# Altium schematic sheet Sheet3.SchDoc
size A
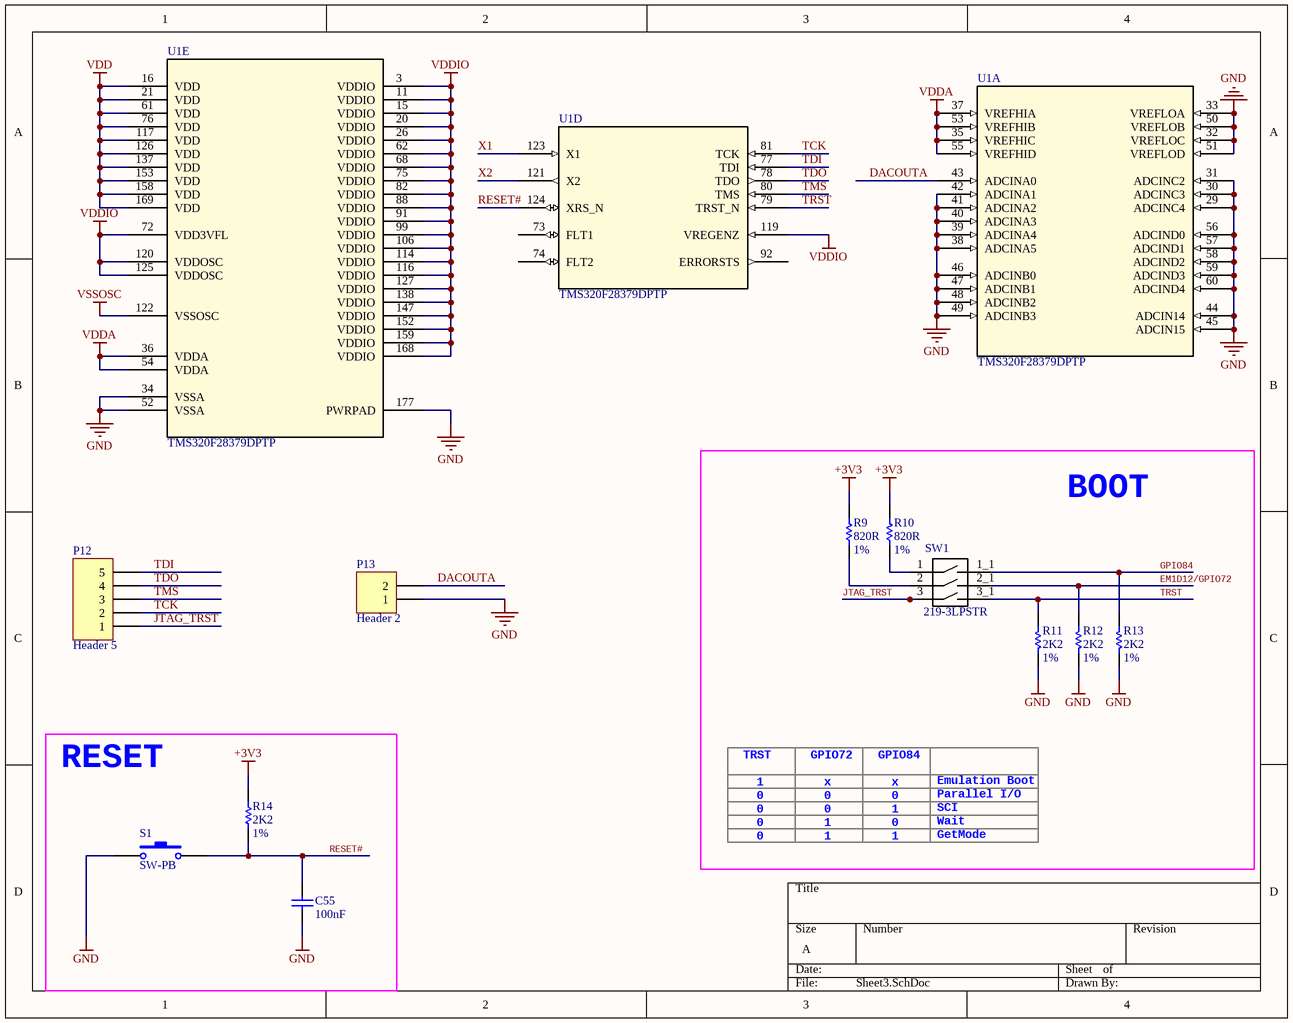
[diagram p0: Sheet3.SchDoc]

## Parts
C55  100nF  [C0805]
P12  Header 5  [HDR1X5]
P13  Header 2  [HDR1X2]
R9  Rating: 1%  [6-0805_L]  (hidden comment: 820R)
R10  Rating: 1%  [6-0805_L]  (hidden comment: 820R)
R11  Rating: 1%  [6-0805_L]  (hidden comment: 2K2)
R12  Rating: 1%  [6-0805_L]  (hidden comment: 2K2)
R13  Rating: 1%  [6-0805_L]  (hidden comment: 2K2)
R14  Rating: 1%  [6-0805_L]  (hidden comment: 2K2)
S1  SW-PB  [SW PB]
SW1  219-3LPSTR  [3Switch*SW_219-3LPSTR3W219-3LPSTR(Primary)]
U1  TMS320F28379DPTP  [PTP0176F_L]  (parts A,D,E of 5)

## Blocks framed on the sheet
BOOT: R9-R13 SW1
RESET: C55 R14 S1

## Nets
+3V3: R9.2 R10.2 R14.2
GND: C55.2 P13.1 R11.1 R12.1 R13.1 S1.1 U1.29(ADCINC4) U1.30(ADCINC3) U1.31(ADCINC2) U1.32(VREFLOC) U1.33(VREFLOA) U1.34(VSSA) U1.38(ADCINA5) U1.39(ADCINA4) U1.40(ADCINA3) U1.41(ADCINA2) U1.42(ADCINA1) U1.44(ADCIN14) U1.45(ADCIN15) U1.46(ADCINB0) U1.47(ADCINB1) U1.48(ADCINB2) U1.49(ADCINB3) U1.50(VREFLOB) U1.51(VREFLOD) U1.52(VSSA) U1.56(ADCIND0) U1.57(ADCIND1) U1.58(ADCIND2) U1.59(ADCIND3) U1.60(ADCIND4) U1.177(PWRPAD)
VDD: U1.16(VDD) U1.21(VDD) U1.61(VDD) U1.76(VDD) U1.117(VDD) U1.126(VDD) U1.137(VDD) U1.153(VDD) U1.158(VDD) U1.169(VDD)
VDDA: U1.35(VREFHIC) U1.36(VDDA) U1.37(VREFHIA) U1.53(VREFHIB) U1.54(VDDA) U1.55(VREFHID)
VDDIO: U1.3(VDDIO) U1.11(VDDIO) U1.15(VDDIO) U1.20(VDDIO) U1.26(VDDIO) U1.62(VDDIO) U1.68(VDDIO) U1.72(VDD3VFL) U1.75(VDDIO) U1.82(VDDIO) U1.88(VDDIO) U1.91(VDDIO) U1.99(VDDIO) U1.106(VDDIO) U1.114(VDDIO) U1.116(VDDIO) U1.119(VREGENZ) U1.120(VDDOSC) U1.125(VDDOSC) U1.127(VDDIO) U1.138(VDDIO) U1.147(VDDIO) U1.152(VDDIO) U1.159(VDDIO) U1.168(VDDIO)
VSSOSC: U1.122(VSSOSC)
DACOUTA: P13.2 U1.43(ADCINA0)
EM1D12/GPIO72: R12.2 SW1.2_1
GPIO84: R13.2 SW1.1_1
JTAG_TRST: P12.1 SW1.3
RESET#: C55.1 R14.1 S1.2 U1.124(XRS_N)
TCK: P12.2 U1.81(TCK)
TDI: P12.5 U1.77(TDI)
TDO: P12.4 U1.78(TDO)
TMS: P12.3 U1.80(TMS)
TRST: R11.2 SW1.3_1 U1.79(TRST_N)
X1: U1.123(X1)
X2: U1.121(X2)
NetR9_1: R9.1 SW1.2
NetR10_1: R10.1 SW1.1

Not connected (* = marked no-connect by the designer): U1 73(FLT1) 74(FLT2) 92(ERRORSTS)

## Notes on the sheet
- TRST
- GPIO72
- GPIO84
- 1
- 0
- x
- Emulation Boot
- Parallel I/O
- SCI
- Wait
- GetMode

## Library data of the parts
C55 = 1004001100187: CAP,100NF(0.1uf),+/-10%,X5R,10V,SMD0402; Manufacturer: MURATA; Manufacturer Part Number: GRM155R61A104KA01D; Rating: 10%; Embest PN: 1004001100187; Value: 100nF; Part Type: Ceramic Capacitor
P12 = Header 5: Header, 5-Pin; LatestRevisionDate: 17-Jul-2002; LatestRevisionNote: Re-released for DXP Platform.; Publisher: Altium Limited
P13 = Header 2: Header, 2-Pin; LatestRevisionDate: 17-Jul-2002; LatestRevisionNote: Re-released for DXP Platform.; Publisher: Altium Limited
R9 R10 = 1003001100482: RES,820R,+/-1%,1/16W,SMD0402; Manufacturer: YAGEO; Manufacturer Part Number: RC0402FR-07820RL; Embest PN: 1003001100482; Value: 820R; Part Type: Thick film Resistor
R11-R14 = 1003001100045: RES,2K2,+/-1%,1/16W,SMD0402; Manufacturer: YAGEO; Manufacturer Part Number: RC0402FR-072K2L; Embest PN: 1003001100045; Value: 2K2; Part Type: Thick film Resistor
S1 = SW-PB: DIGIKEY SW400-ND; Published: 24-Mar-1999; LatestRevisionDate: 17-Jul-2002; LatestRevisionNote: Re-released for DXP Platform.; Publisher: Altium Limited
SW1 = 219-3LPSTR: Dip Switch SPST 3 Position Surface Mount Slide _Standard_ Actuator 100mA 20VDC; MF: CTS Electrocomponents; SnapEDA_Link: https://www.snapeda.com/parts/219-3LPSTR/CTS%20Electrocomponents/view-part/571936/?ref=snap; Digi-Key_Part_Number: CT3115CT-ND; MP: 219-3LPSTR; Digi-Key_Purchase_URL: https://www.digikey.com/product-detail/en/cts-electrocomponents/219-3LPSTR/CT3115CT-ND/5875767?utm_source=snapeda&utm_medium=aggregator&utm_campaign=symbol; Package: None; Value: *
U1 = TMS320F28379DPTP: Imported; PartNumber: TMS320F28379DPTPS; Manufacturer: Texas Instruments; RefDes: RefDes; TYPE: TYPE; Value: Value